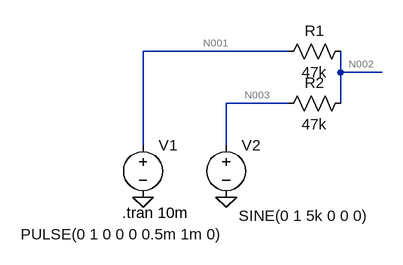
[diagram p0: schematic Draft1.asc]
Draft1.asc, the LTspice schematic file:
Version 4
SHEET 1 880 680
WIRE 288 80 64 80
WIRE 368 112 368 80
WIRE 432 112 368 112
WIRE 288 160 192 160
WIRE 368 160 368 112
WIRE 64 224 64 80
WIRE 192 224 192 160
FLAG 64 304 0
FLAG 192 304 0
SYMBOL voltage 64 208 R0
WINDOW 3 -188 153 Left 2
WINDOW 123 0 0 Left 2
WINDOW 39 0 0 Left 2
SYMATTR Value PULSE(0 1 0 0 0 0.5m 1m 0)
SYMATTR InstName V1
SYMBOL voltage 192 208 R0
WINDOW 3 19 125 Left 2
WINDOW 123 0 0 Left 2
WINDOW 39 0 0 Left 2
SYMATTR Value SINE(0 1 5k 0 0 0)
SYMATTR InstName V2
SYMBOL res 384 64 R90
WINDOW 0 0 56 VBottom 2
WINDOW 3 32 56 VTop 2
SYMATTR InstName R1
SYMATTR Value 47k
SYMBOL res 384 144 R90
WINDOW 0 0 56 VBottom 2
WINDOW 3 32 56 VTop 2
SYMATTR InstName R2
SYMATTR Value 47k
TEXT 32 328 Left 2 !.tran 10m

The netlist it stands for:
* Draft1.asc
V1 N001 0 PULSE(0 1 0 0 0 0.5m 1m 0)
V2 N003 0 SINE(0 1 5k 0 0 0)
R1 N002 N001 47k
R2 N002 N003 47k
.tran 10m
.backanno
.end

* Results of the author's LTspice run, read from the files saved beside the schematic
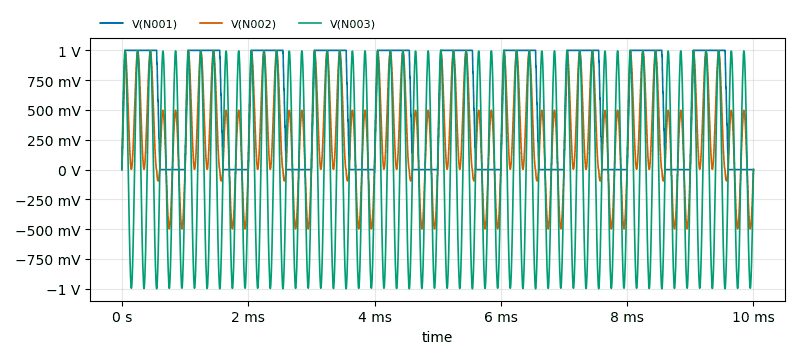
[diagram p1: Transient Analysis of Draft1.asc, plotted from the saved traces]
* Transient Analysis, 1 run:
*   V(N001): min 0 V, max 1 V, average 550 mV, rms 730.6 mV, last 0 V
*   V(N002): min -498.4 mV, max 1 V, average 275 mV, rms 505.7 mV, last 0 V
*   V(N003): min -1 V, max 1 V, average 46.09 µV, rms 699.5 mV, last 0 V